# Altium schematic sheet Peripherial.SchDoc
size A3
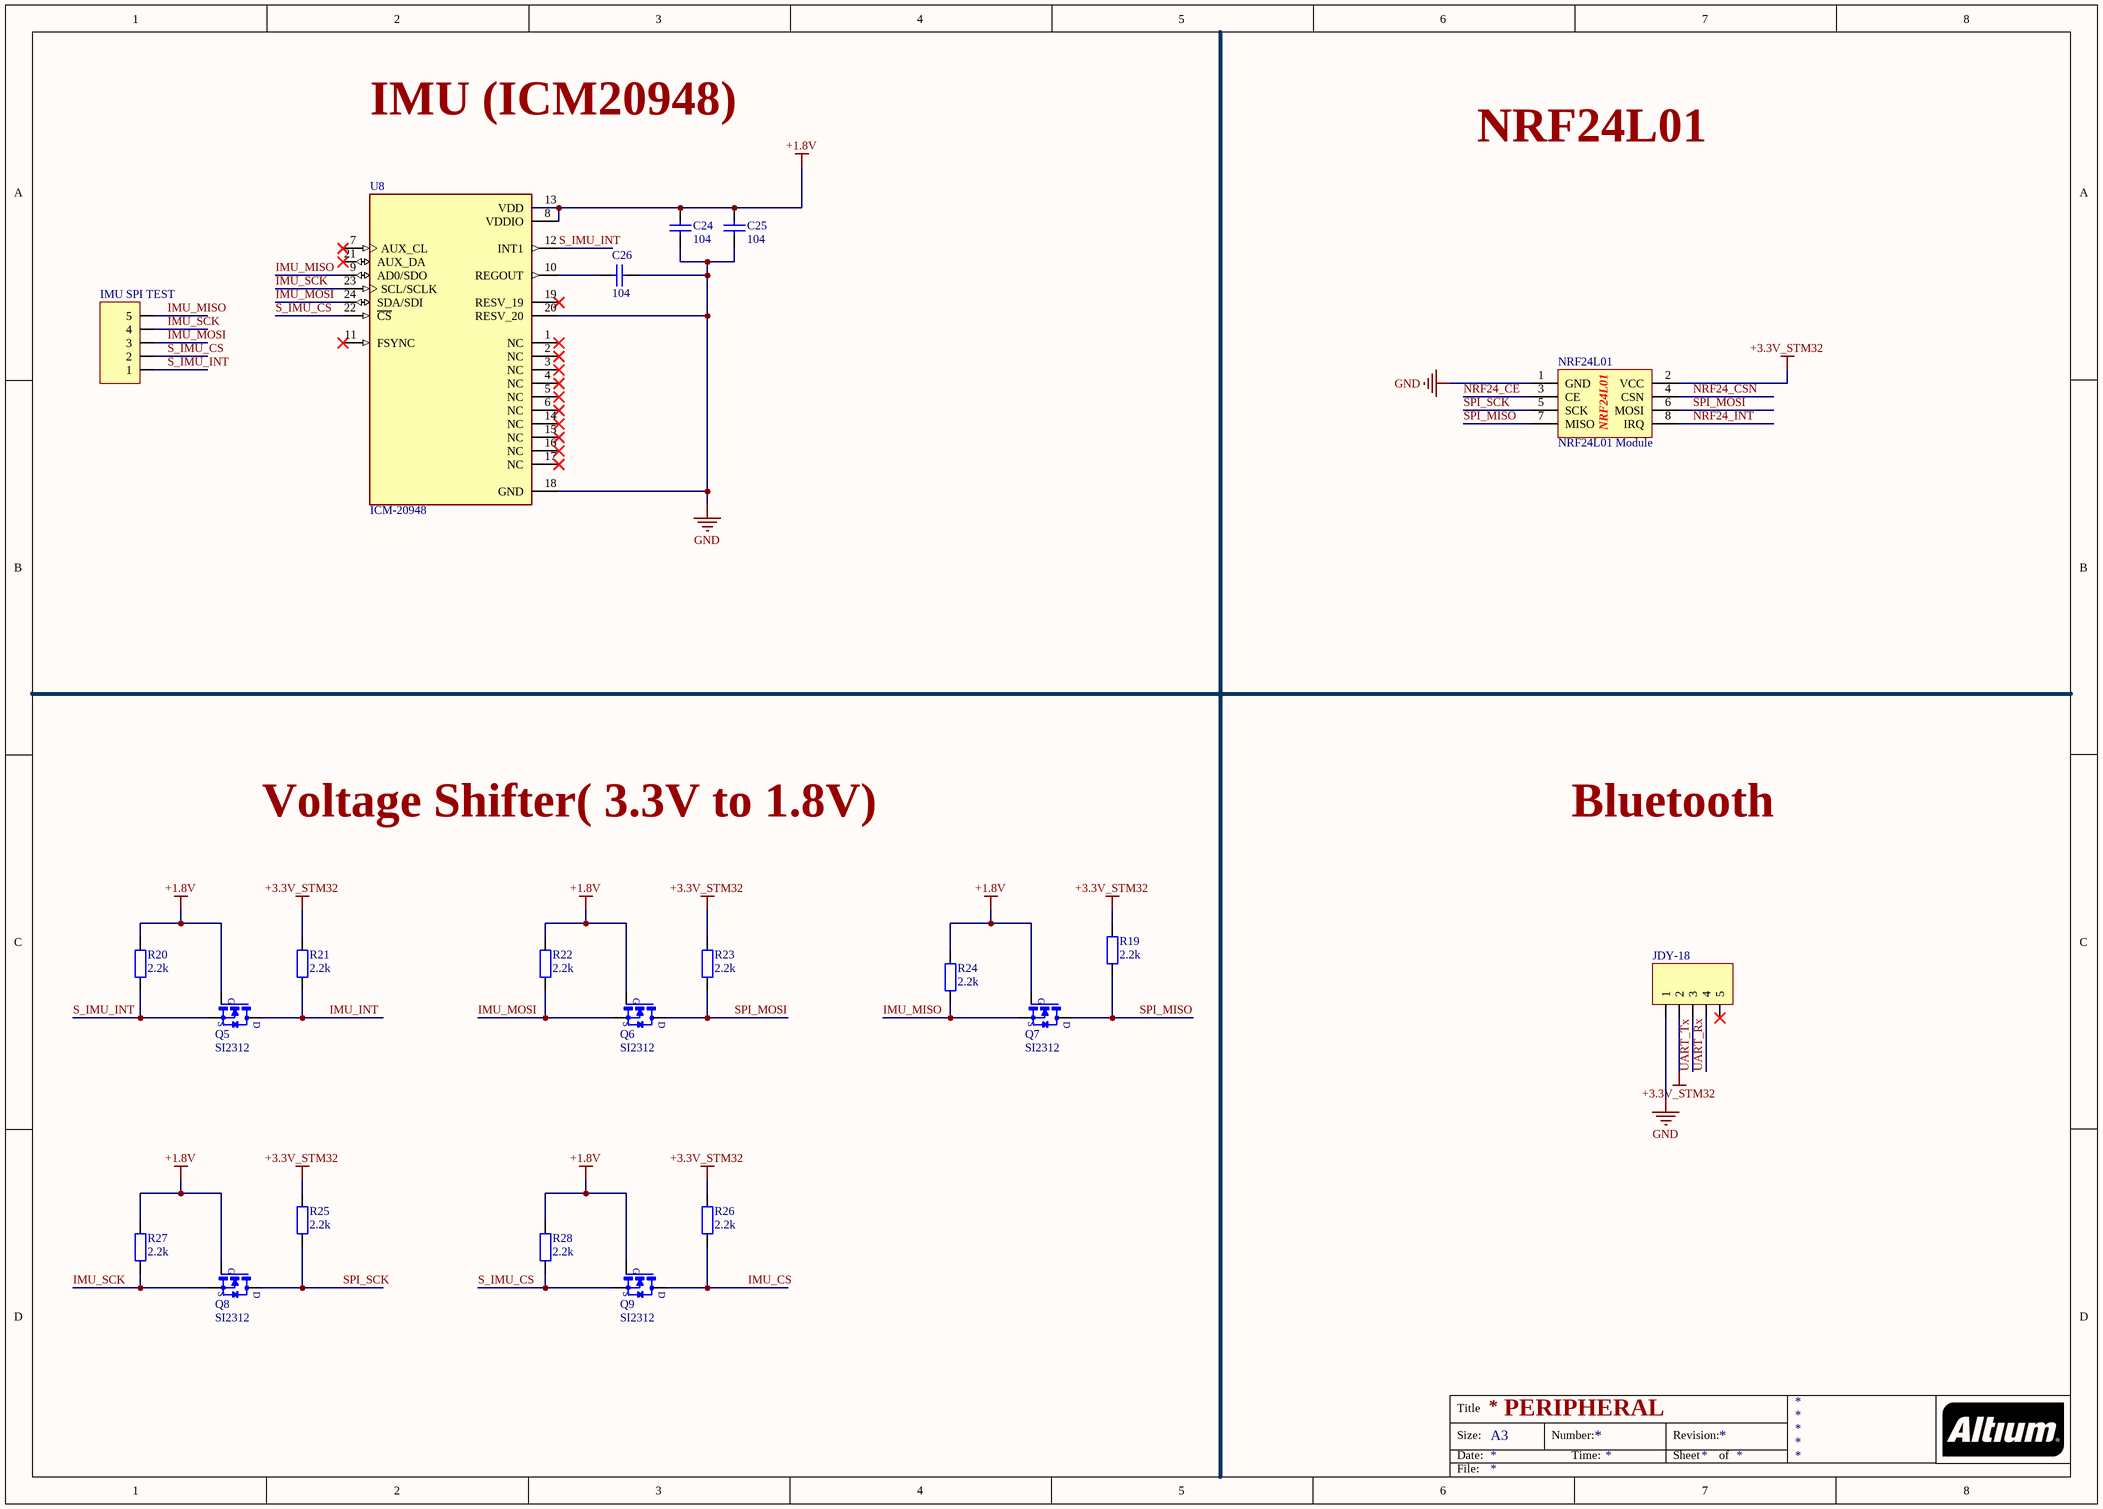
[diagram p0: Peripherial.SchDoc]

## Parts
C24  104  [tu 1206]
C25  104  [tu 1206]
C26  104  [tu 1206]
IMU_SPI_TEST  (no value)  [JP 1x5 DT]
JDY-18  JP 1x5 2.54  [JP 1x5 CC]  (value not drawn)
NRF24L01  NRF24L01 Module  [NRF24L01]
Q5  SI2312  [SOT23]
Q6  SI2312  [SOT23]
Q7  SI2312  [SOT23]
Q8  SI2312  [SOT23]
Q9  SI2312  [SOT23]
R19  2.2k  [tro smd 0603]
R20  2.2k  [tro smd 0603]
R21  2.2k  [tro smd 0603]
R22  2.2k  [tro smd 0603]
R23  2.2k  [tro smd 0603]
R24  2.2k  [tro smd 0603]
R25  2.2k  [tro smd 0603]
R26  2.2k  [tro smd 0603]
R27  2.2k  [tro smd 0603]
R28  2.2k  [tro smd 0603]
U8  ICM-20948  [QFN40P300X300X105-24N]

## Nets
+1.8V: C24.1 C25.1 Q5.1(G) Q6.1(G) Q7.1(G) Q8.1(G) Q9.1(G) R20.2 R22.2 R24.2 R27.2 R28.2 U8.8(VDDIO) U8.13(VDD)
+3.3V_STM32: JDY-18.2 NRF24L01.2(VCC) R19.2 R21.2 R23.2 R25.2 R26.2
GND: C24.2 C25.2 C26.2 JDY-18.1 NRF24L01.1(GND) U8.18(GND) U8.20(RESV_20)
IMU_CS: Q9.3(D) R26.1
IMU_INT: Q5.3(D) R21.1
IMU_MISO: IMU_SPI_TEST.5 Q7.2(S) R24.1 U8.9(AD0/SDO)
IMU_MOSI: IMU_SPI_TEST.3 Q6.2(S) R22.1 U8.24(SDA/SDI)
IMU_SCK: IMU_SPI_TEST.4 Q8.2(S) R27.1 U8.23(SCL/SCLK)
NRF24_CE: NRF24L01.3(CE)
NRF24_CSN: NRF24L01.4(CSN)
NRF24_INT: NRF24L01.8(IRQ)
S_IMU_CS: IMU_SPI_TEST.2 Q9.2(S) R28.1 U8.22(~{CS})
S_IMU_INT: IMU_SPI_TEST.1 Q5.2(S) R20.1 U8.12(INT1)
SPI_MISO: NRF24L01.7(MISO) Q7.3(D) R19.1
SPI_MOSI: NRF24L01.6(MOSI) Q6.3(D) R23.1
SPI_SCK: NRF24L01.5(SCK) Q8.3(D) R25.1
UART_Rx: JDY-18.4
UART_Tx: JDY-18.3
NetC26_1: C26.1 U8.10(REGOUT)

Not connected (* = marked no-connect by the designer): JDY-18 5*; U8 1(NC)* 2(NC)* 3(NC)* 4(NC)* 5(NC)* 6(NC)* 7(AUX_CL)* 11(FSYNC)* 14(NC)* 15(NC)* 16(NC)* 17(NC)* 19(RESV_19)* 21(AUX_DA)*

## Notes on the sheet
- IMU (ICM20948)
- NRF24L01
- Voltage Shifter( 3.3V to 1.8V)
- Bluetooth
- PERIPHERAL
- Title
- Size:
- Date:
- A3
- Number:
- Time:
- Revision:
- Sheet
- of
- File:

## Library data of the parts
C24-C26 = Tu 1206 104 50V 20%: Dán; Don_Vi: Con; So_Chan: 2; Ten_Linh_Kien: Tụ 1206 104-0.1uF 20% 50V; Ma_Hang: MH004544; Chung_Loai: Dán; Kieu_Chan: *
IMU_SPI_TEST = JP 1x5 2.54 Duc Thang: Cắm; Ten_Linh_Kien: Jump Đơn Đực 2.54MM 1x40P Thẳng 11MM; Don_Vi: Con; Ma_Hang: MH000903; Ghi_Chu: *; Kieu_Chan: *; Chung_Loai: Cắm
JDY-18 = JP 1x5 2.54 Cai Cong: Cắm; Ten_Linh_Kien: Jump Đơn Cái 2.54MM 1x40P Cong; Don_Vi: Con; Ma_Hang: MH001265; Ghi_Chu: *; Kieu_Chan: *; Chung_Loai: Cắm
Q5-Q9 = SI2312: <b>N-Channel MOSFET</b>    <a href="https://pricing.snapeda.com/parts/SI2312/Micro%20Commercial%20Components/view-part?ref=eda">Check availability</a> <a href="https://pricing.snapeda.com/parts/SI2312/Micro%20Commercial%20Components/view-part?ref=eda">Check availability</a>; MF: {'manufacturer': u'Micro Commercial Components'}; MP: SI2312-TP; Package: None; Price: None; Value: *; Availability: Unavailable
R19-R28 = Tro 0603 5% 2.2k: Dán; Don_Vi: Con; So_Chan: 2; Ten_Linh_Kien: Trở 0603 5% 2.2k; Ma_Hang: MH006321; Chung_Loai: Dán; Kieu_Chan: *
U8 = ICM-20948: Accelerometer, Gyroscope, Magnetometer, 9 Axis Sensor IÂ²C, SPI Output; MF: {'manufacturer': u'TDK InvenSense'}; Package: None; Price: None; Value: *; MP: ICM-20948; Availability: Unavailable